# EasyEDA schematic easyeda-gba-sp-usb-c-schematic.json
TITLE: Sheet_1; REV: 1.0; Date: 2020-05-05; Sheet: 1/1; Drawn By: rorosaurus; Company: Your Company
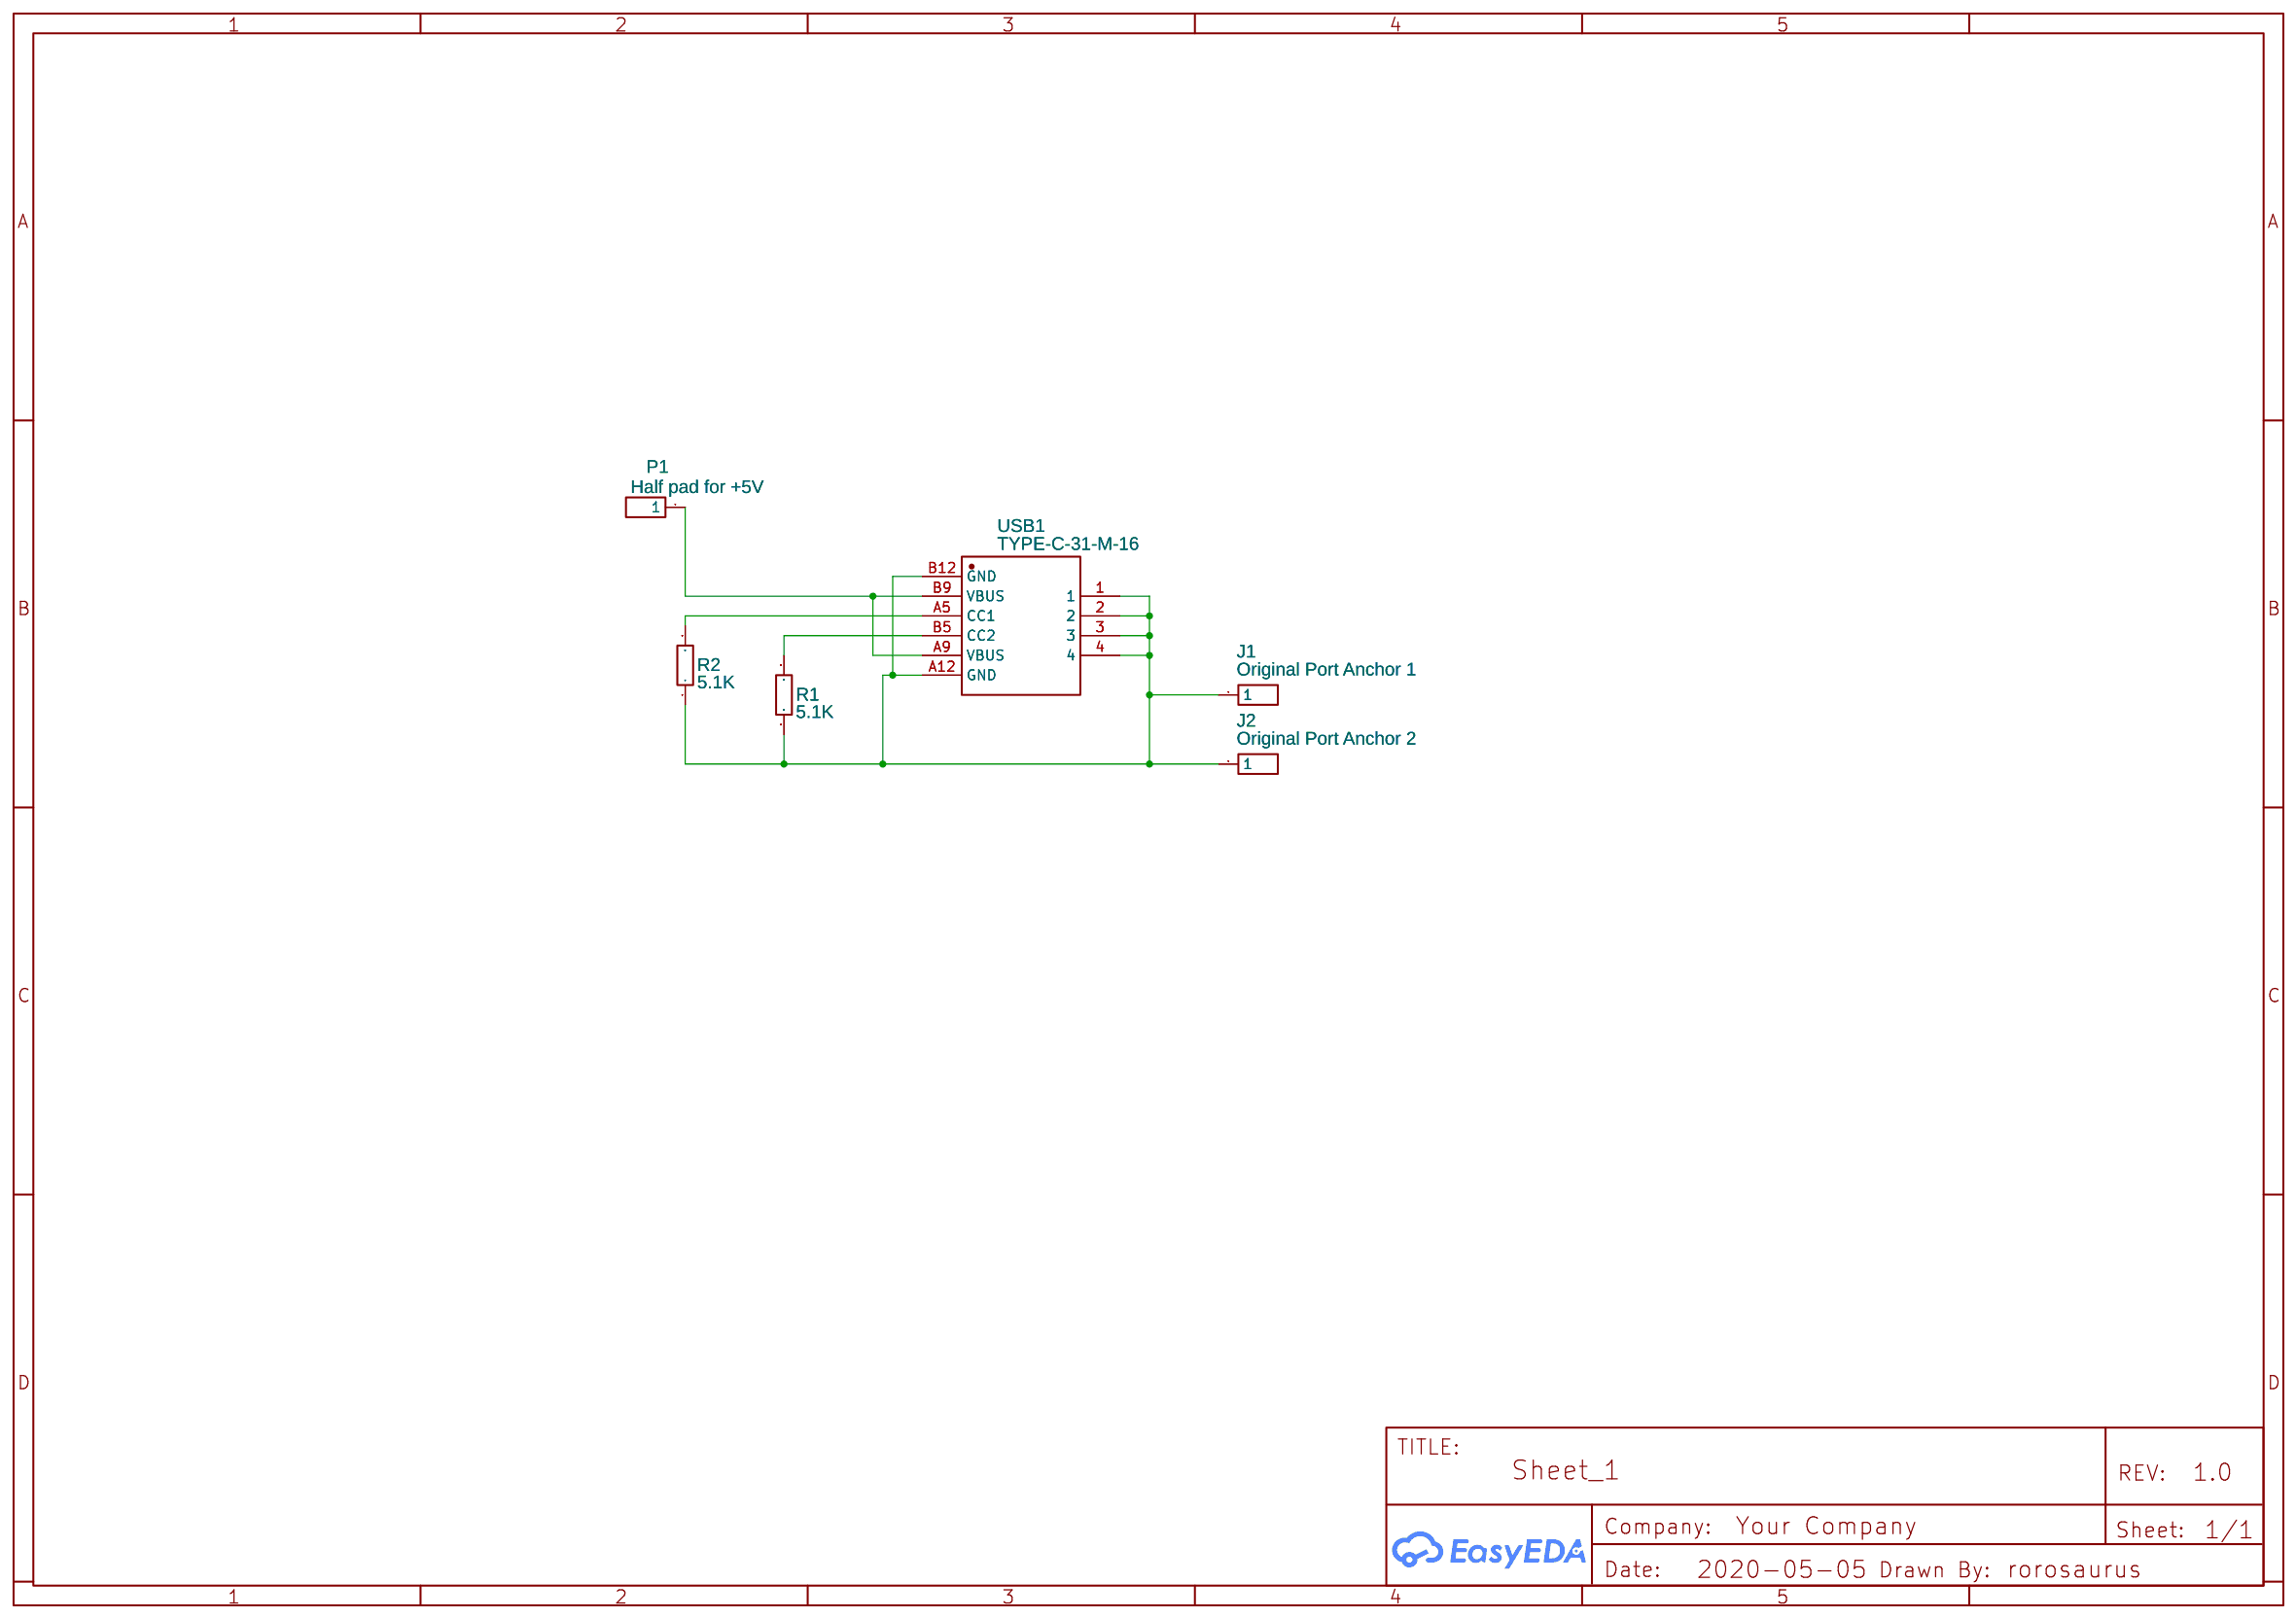
[diagram p0: schematic sheet]

## Parts
J1  Original Port Anchor 1  [HDR-M-2.54_1X1]
J2  Original Port Anchor 2  [HDR-M-2.54_1X1]
P1  Half pad for +5V  [HDR-1X1/2.54]
R1  5.1K  [R0402]
R2  5.1K  [R0402]
USB1  TYPE-C-31-M-16  [TYPE-C-SMD_TYPE-C-31-M-16]

## Library data of the parts
J1 J2 = HDR-M-2.54_1x1: Supplier Part: C81276; Supplier: LCSC; Contributor: LCEDA_Lib
P1 = -: Supplier: LCSC; Manufacturer: ReliaPro; Manufacturer Part: Header-Male-2.54_1x1; Supplier Part: C81276
R1 R2 = RMC04025.1K5%N: Supplier: LCSC; Supplier Part: C325524; Manufacturer: Tyohm; Contributor: LCSC
USB1 = -: Supplier: LCSC; Supplier Part: C283541; Manufacturer: Korean Hroparts Elec; Contributor: LCSC

## Nets
Net-(J1-1): J1.1 J2.1 R1.1 R2.1 USB1.1 USB1.2 USB1.3 USB1.4 USB1.A12(GND) USB1.B12(GND)
Net-(P1-1): P1.1 USB1.A9(VBUS) USB1.B9(VBUS)
Net-(R1-2): R1.2 USB1.B5(CC2)
Net-(R2-2): R2.2 USB1.A5(CC1)
